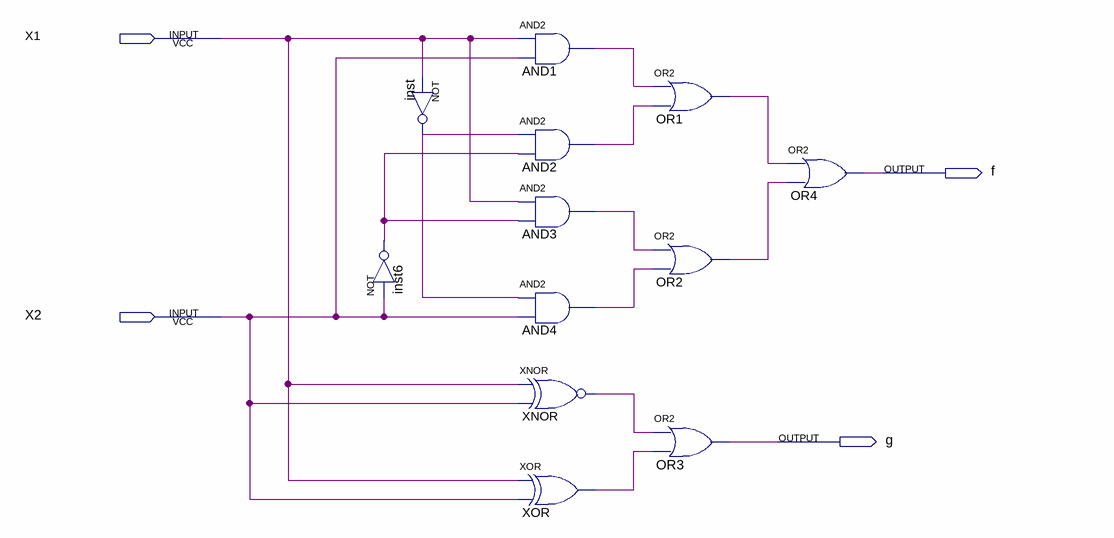
[diagram p0: schematic sheet]
// Quartus schematic Lab02.bdf as structural Verilog: 12 symbols, 4 pins
module Lab02 (
  input  X1,
  input  X2,
  output f,
  output g
);

  wire AND1_out, AND2_out, AND3_out, AND4_out, inst6_out, inst_out, OR1_out, OR2_out, XNOR_out, XOR_out;

  not inst6 (inst6_out, X2);
  not inst (inst_out, X1);
  and AND1 (AND1_out, X1, X2);
  and AND2 (AND2_out, inst_out, inst6_out);
  and AND3 (AND3_out, X1, inst6_out);
  and AND4 (AND4_out, inst_out, X2);
  xnor XNOR (XNOR_out, X1, X2);
  xor XOR (XOR_out, X1, X2);
  or OR1 (OR1_out, AND1_out, AND2_out);
  or OR2 (OR2_out, AND3_out, AND4_out);
  or OR3 (g, XNOR_out, XOR_out);
  or OR4 (f, OR1_out, OR2_out);
endmodule
